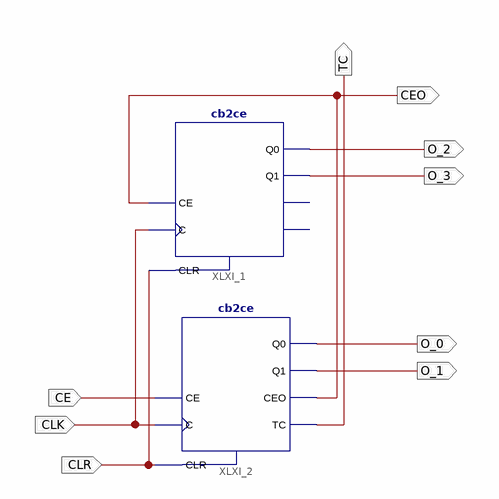
[diagram p0: schematic sheet 1]
// Xilinx ISE schematic count_test.sch (spartan6) as structural Verilog: 2 symbols, 9 ports
module count_test (
  input  CLR,
  input  CE,
  input  CLK,
  output TC,
  output CEO,
  output O_0,
  output O_1,
  output O_2,
  output O_3
);

  cb2ce XLXI_1 (.C(CLK), .CE(CEO), .CLR(CLR), .Q0(O_2), .Q1(O_3));  // open: CEO, TC
  cb2ce XLXI_2 (.C(CLK), .CE(CE), .CLR(CLR), .CEO(CEO), .Q0(O_0), .Q1(O_1), .TC(TC));
endmodule
